# Altium project Project2.PrjPcb
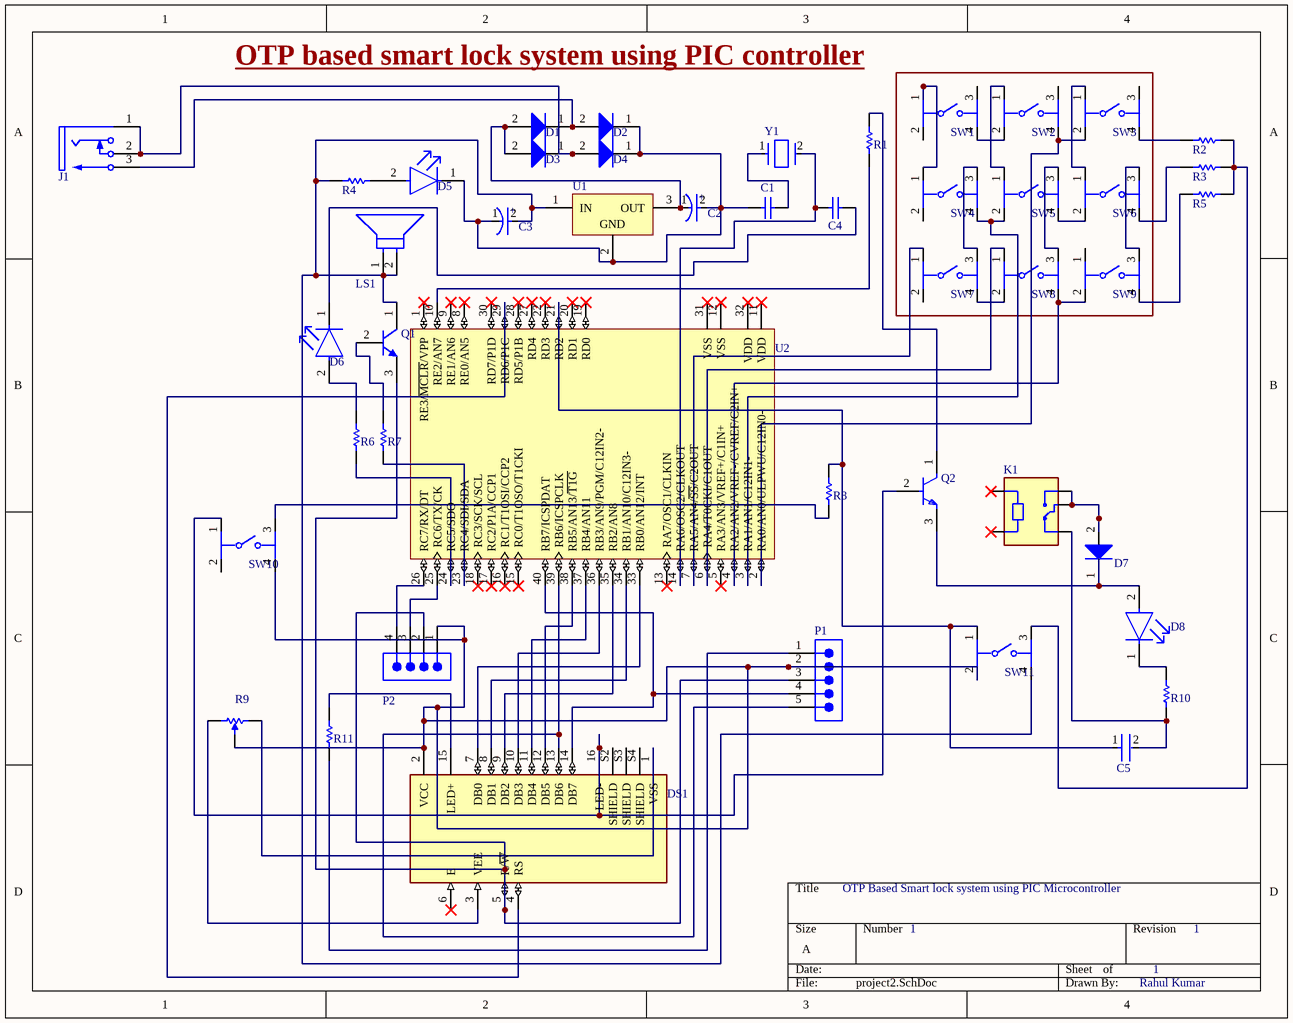
[diagram p0: project2.SchDoc]
1 sheet, 46 parts. Net scope: global (net labels, ports and power ports of the same name join across sheets).
Board files: project2.PcbDoc, PCB1.PcbDoc

## Sheet project2.SchDoc
size A; SheetNumber: 1; SheetTotal: 1

### Parts
C1  GRM188R71H102KA01D  [CAPC1608X90X35NL10T15]  (value not drawn)
C2  EEUFM1V221L  [FP-RAD-TH-D_8_0_5-L_15_1-MFG]  (value not drawn)
C3  EEUHD1E101  [FP-RAD-TH-D_6_3_0_5-L_11-MFG]  (value not drawn)
C4  GRM188R71H102KA01D  [CAPC1608X90X35NL10T15]  (value not drawn)
C5  06035A221JAT2A  [FP-0603-L_1_6_0_15-W_0_81-IPC_B]  (value not drawn)
D1  BAT54HT1G  [ONSC-SOD-323-2-477-02_V]  (value not drawn)
D2  BAT54HT1G  [ONSC-SOD-323-2-477-02_V]  (value not drawn)
D3  BAT54HT1G  [ONSC-SOD-323-2-477-02_V]  (value not drawn)
D4  BAT54HT1G  [ONSC-SOD-323-2-477-02_V]  (value not drawn)
D5  LTST-C190GKT  [FP-LTST-C190GKT-MFG]  (value not drawn)
D6  LTST-C190GKT  [FP-LTST-C190GKT-MFG]  (value not drawn)
D7  BAT54HT1G  [ONSC-SOD-323-2-477-02_V]  (value not drawn)
D8  LTST-C190GKT  [FP-LTST-C190GKT-MFG]  (value not drawn)
DS1  RC1602B-BIW-CSV  [LCD_RC1602B-BIW-CSV]  (value not drawn)
J1  RAPC712X  [SWITCH-RAPC712X-3_V]  (value not drawn)
K1  SRD-05VDC-SL-C  [RELAY_SRD-05VDC-SL-C]  (value not drawn)
LS1  PKM17EPPH4001-B0  [FP-PKM17EPPH4001-B0-MFG]  (value not drawn)
P1  653105124022  [653105124022]  (value not drawn)
P2  679304124022  [679304124022]  (value not drawn)
Q1  BC547B  [ONSC-TO-92-3-29-11]  (value not drawn)
Q2  BC548  [FP-135AN-MFG]  (value not drawn)
R1  ERJ-8GEY0R00V  [RESC3216X70X50NL05T20]  (value not drawn)
R2  ERJ-8GEY0R00V  [RESC3216X70X50NL05T20]  (value not drawn)
R3  ERJ-8GEY0R00V  [RESC3216X70X50NL05T20]  (value not drawn)
R4  ERJ-8GEY0R00V  [RESC3216X70X50NL05T20]  (value not drawn)
R5  ERJ-8GEY0R00V  [RESC3216X70X50NL05T20]  (value not drawn)
R6  ERJ-8GEY0R00V  [RESC3216X70X50NL05T20]  (value not drawn)
R7  ERJ-8GEY0R00V  [RESC3216X70X50NL05T20]  (value not drawn)
R8  ERJ-8GEY0R00V  [RESC3216X70X50NL05T20]  (value not drawn)
R9  3296W-1-102LF  [BOUR-3296W-1-3]  (value not drawn)
R10  ERJ-8GEY0R00V  [RESC3216X70X50NL05T20]  (value not drawn)
R11  ERJ-8GEY0R00V  [RESC3216X70X50NL05T20]  (value not drawn)
SW1  1-1825910-4  [FP-1-1825910-4-MFG]  (value not drawn)
SW2  1-1825910-4  [FP-1-1825910-4-MFG]  (value not drawn)
SW3  1-1825910-4  [FP-1-1825910-4-MFG]  (value not drawn)
SW4  1-1825910-4  [FP-1-1825910-4-MFG]  (value not drawn)
SW5  1-1825910-4  [FP-1-1825910-4-MFG]  (value not drawn)
SW6  1-1825910-4  [FP-1-1825910-4-MFG]  (value not drawn)
SW7  1-1825910-4  [FP-1-1825910-4-MFG]  (value not drawn)
SW8  1-1825910-4  [FP-1-1825910-4-MFG]  (value not drawn)
SW9  1-1825910-4  [FP-1-1825910-4-MFG]  (value not drawn)
SW10  1-1825910-4  [FP-1-1825910-4-MFG]  (value not drawn)
SW11  1-1825910-4  [FP-1-1825910-4-MFG]  (value not drawn)
U1  L7805CV  [TO220]  (value not drawn)
U2  PIC16F887-I/P  [PDIP600-P40]  (value not drawn)
Y1  ABLS-8.000MHZ-B2-T  [FP-ABLS-MFG]  (value not drawn)

### Nets
NetC1_1: C1.1 C2.2(A) C3.1(C) D2.1(K) D4.1(K) D5.1(C) U1.2(GND)
NetC1_2: C1.2 Y1.1
NetC2_1: C2.1(C) D1.2(A) D3.2(A) U1.3(OUT)
NetC3_2: C3.2(A) LS1.1 LS1.2 Q1.1(C) R4.2 SW11.4 U1.1(IN)
NetC4_1: C4.1 D6.1(C)
NetC4_2: C4.2 U2.14(RA6/OSC2/CLKOUT) Y1.2
NetC5_1: C5.1 R8.2 SW11.1 U2.21(RD2)
NetC5_2: C5.2 K1.NC R10.1
NetD1_1: D1.1(K) D2.2(A) J1.3
NetD3_1: D3.1(K) D4.2(A) J1.1 J1.2
NetD5_2: D5.2(A) R4.1
NetD6_2: D6.2(A) R6.2
NetD7_1: D7.1(K) D8.2(A) Q2.3(E)
NetD7_2: D7.2(A) K1.COM K1.NO
NetD8_1: D8.1(C) R10.2
NetDS1_1: DS1.1(VSS) R9.2(B)
NetDS1_2: DS1.2(VCC) P1.2 P2.1 R9.3(TAP) SW10.4 SW11.2
NetDS1_3: DS1.3(VEE) R9.1(A)
NetDS1_4: DS1.4(RS) U2.29(RD6/P1C)
NetDS1_5: DS1.5(R/~{W}) P1.3 P2.2 Q1.3(E)
NetDS1_7: DS1.7(DB0) U2.33(RB0/AN12/INT)
NetDS1_8: DS1.8(DB1) U2.34(RB1/AN10/C12IN3-)
NetDS1_9: DS1.9(DB2) U2.35(RB2/AN8)
NetDS1_10: DS1.10(DB3) U2.36(RB3/AN9/PGM/C12IN2-)
NetDS1_11: DS1.11(DB4) U2.37(RB4/AN11)
NetDS1_12: DS1.12(DB5) U2.38(RB5/AN13/~{T1G})
NetDS1_13: DS1.13(DB6) P1.5 U2.39(RB6/ICSPCLK)
NetDS1_14: DS1.14(DB7) P1.4 U2.40(RB7/ICSPDAT)
NetDS1_15: DS1.15(LED+) R11.2
NetDS1_16: DS1.16(LED-) Q2.2(B) SW10.1
NetP1_1: P1.1 R11.1
NetP2_3: P2.3 U2.25(RC6/TX/CK)
NetP2_4: P2.4 U2.26(RC7/RX/DT)
NetQ1_2: Q1.2(B) R7.2
NetQ2_1: Q2.1(C) R1.1
NetR1_2: R1.2 U2.10(RE2/AN7)
NetR2_1: R2.1 R3.1 R5.1 SW11.3
NetR2_2: R2.2 SW3.4
NetR3_2: R3.2 SW6.4
NetR5_2: R5.2 SW9.4
NetR6_1: R6.1 U2.24(RC5/SDO)
NetR7_1: R7.1 U2.23(RC4/SDI/SDA)
NetR8_1: R8.1 SW10.3
NetSW1_1: SW1.1 SW4.1
NetSW1_4: SW1.4 SW2.2
NetSW2_1: SW2.1 SW5.1
NetSW2_4: SW2.4 SW3.2 U2.2(RA0/AN0/ULPWU/C12IN0-)
NetSW3_1: SW3.1 SW6.1
NetSW4_3: SW4.3 SW7.3
NetSW4_4: SW4.4 SW5.2 U2.3(RA1/AN1/C12IN1-)
NetSW5_3: SW5.3 SW8.3
NetSW5_4: SW5.4 SW6.2
NetSW6_3: SW6.3 SW9.3
NetSW7_1: SW7.1 U2.7(RA5/AN4/~{SS}/C2OUT)
NetSW7_4: SW7.4 SW8.2
NetSW8_1: SW8.1 U2.6(RA4/T0CKI/C1OUT)
NetSW8_4: SW8.4 SW9.2 U2.4(RA2/AN2/VREF-/CVREF/C2IN+)

Not connected (* = marked no-connect by the designer): DS1 6(E)* S2(SHIELD) S3(SHIELD) S4(SHIELD); K1 A1* A2*; SW1 2 3; SW2 3; SW3 3; SW4 2; SW7 2; SW9 1; SW10 2; U2 1(RE3/~{MCLR}/VPP)* 5(RA3/AN3/VREF+/C1IN+)* 8(RE0/AN5)* 9(RE1/AN6)* 11(VDD)* 12(VSS)* 13(RA7/OSC1/CLKIN)* 15(RC0/T1OSO/T1CKI)* 16(RC1/T1OSI/CCP2)* 17(RC2/P1A/CCP1)* 18(RC3/SCK/SCL)* 19(RD0)* 20(RD1)* 22(RD3)* 27(RD4)* 28(RD5/P1B)* 30(RD7/P1D)* 31(VSS)* 32(VDD)*

### Notes on the sheet
- OTP based smart lock system using PIC controller
- OTP Based Smart lock system using PIC Microcontroller
- 1
- Rahul Kumar
- (in symbol CMP-05427-000678-1) +
- (in symbol CMP-05427-000916-1) +

### Library data of the parts
C1 C4 = CMP-2006-02891-1: Manufacturer: Murata; Part Number: GRM188R71H102KA01D
C2 = CMP-05427-000678-1: Aluminum Electrolytic Capacitors (Radial Lead Type) 220uF ±20% 35V; Ripple Current: 1.24A; Impedance: 41mR; Lead Length: 17mm; Life (Hours): 3000Hour; Lead Diameter: 0.6mm; Dielectric Material: Aluminium; Dissipation Factor: 0.12%; Package Quantity: 200; Tolerance: 20%; Series: FM; Voltage Rating: 35V; Lead Pitch: 3.5mm; Radiation Hardening: No; Construction: RADIAL; RoHS Compliant: Yes; REACH SVHC: Yes; Lead Free: Lead Free; Height - Seated (Max): 0.65inch; Length: 15mm; Diameter: 8mm; Mount: Through Hole; Number of Pins: 2; Height: 15mm; Voltage: 35V; Case/Package: Radial; Packaging: Bulk; Min Operating Temperature: -40°C; Voltage Rating (DC): 35V; ESR (Equivalent Series Resistance): 41mR; Capacitance: 220uF; Max Operating Temperature: 105°C; Termination: Radial
C3 = CMP-05427-000916-1: Aluminum Electrolytic Capacitors (Radial Lead Type) AEC-Q200 Qualified 100uF ±20% 25V; Ripple Current: 130mA; Lead/Base Style: Straight; Lead Diameter: 0.5mm; Life (Hours): 1000Hour; Polarity: Polar; Radiation Hardening: No; Voltage Rating: 25V; Tolerance: 20%; Series: Automotive, AEC-Q200, HD; Case/Package: Radial; REACH SVHC: No SVHC; Packaging: Bulk; Lead Pitch: 2.5mm; Mount: Through Hole; Min Operating Temperature: -55°C; Diameter: 6.3mm; Height - Seated (Max): 0.5inch; Capacitance: 100uF; Max Operating Temperature: 105°C; Construction: RADIAL; Package Quantity: 200; Termination: Radial; Height: 11.2mm; Ripple Current (AC): 130mA; RoHS Compliant: Yes; Voltage Rating (DC): 25V; Voltage: 25V; Number of Pins: 2; Length: 11.2mm
C5 = CMP-2006-04275-2: General Purpose Ceramic Capacitor, 0603, 220pF, 5%, NP0, 30ppm/°C, 50V; Insulation Resistance: 100GR; Dielectric: C0G; REACH SVHC: No SVHC; Height: 0.63mm; Lead Free: Lead Free; Case/Package: 0603; Package Quantity: 1; Length: 1.6mm; Min Operating Temperature: -55°C; Temperature Coefficient: 30ppm/°C; Width: 0.81mm; Voltage Rating: 50V; Capacitance: 220pF; Tolerance: 5%; Dielectric Material: Ceramic; Contact Plating: Tin; Thickness: 0.035inch; Mount: Surface Mount; Case Code (Imperial): 0603; Depth: 0.81mm; Voltage Rating (DC): 50V; Number of Pins: 2; RoHS Compliant: Yes; Packaging: Tape and Reel; Voltage: 50V; Case Code (Metric): 1608; Max Operating Temperature: 125°C; Termination: SMD/SMT; Radiation Hardening: No
D1-D4 D7 = CMP-1055-00462-1: Schottky Barrier Diode, 2-Pin SOD-323, Pb-Free, Tape and Reel; Manufacturer: On Semiconductor; Configuration: Single; trr Max (ns): 5; IFSM Max (A): 0.6; ComponentLink3URL: http://www.onsemi.com/pub_link/Collateral/477-02.PDF.1; PackageDescription: 2-Pin SOD, Body 1.7 x 1.25 mm; ComponentLink2URL: http://www.onsemi.cn/pub_link/Collateral/BAT54HT1-D.PDF; ComponentLink3Description: Package Specification; ComponentLink2Description: Datasheet; DatasheetVersion: Rev. 6; PackageReference: SOD-323-2-477-02; RoHS: TRUE; ComponentLink1URL: http://www.onsemi.com/; Packing: Tape and Reel; PartNumber: BAT54HT1G; Mounting Technology: Surface Mount; ComponentLink1Description: Manufacturer URL; PackageVersion: Rev. H, 03/2007
D5 D6 D8 = CMP-22017-000005-2: LED GREEN CLEAR CHIP SMD; Dominant Wavelength: 569nm; Reverse Voltage: 5V; Lens Color: Colorless; Viewing Angle: 130°; Voltage: 2V; Forward Current: 30mA; Power Dissipation: 100mW; Luminous Intensity: 6mcd; Number of LEDs: 1; Forward Voltage: 2.1V; Wavelength: 565nm; Test Current: 10mA; Min Operating Temperature: -55°C; Lens Style: Clear; Mount: Surface Mount; Width: 0.8mm; Packaging: Tape and Reel; Lens Transparency: Clear; Case Code (Metric): 1608; Depth: 0.8mm; Case Code (Imperial): 0603; Case/Package: 0603; Number of Pins: 2; Max Operating Temperature: 85°C; Lead Free: Lead Free; Number of Elements: 1; Length: 1.6mm; Height: 0.8mm; Package Quantity: 1; Power Rating: 100mW; Radiation Hardening: No; Illumination Color: Green; Color: Green
DS1 = RC1602B-BIW-CSV: Display: LCD; alphanumeric; STN Negative; 16x2; blue; LED; PIN: 16; MF: Raystar; Value: *; SnapEDA_Link: https://www.snapeda.com/parts/RC1602B-BIW-CSV/Raystar/view-part/?ref=snap; Availability: Not in stock; Price: None; Package: None; Check_prices: https://www.snapeda.com/parts/RC1602B-BIW-CSV/Raystar/view-part/?ref=eda; MP: RC1602B-BIW-CSV
J1 = CMP-2000-05383-1: Conn Powerjack Mini R/A PCMT, 5 A, 3-Pin THD, RoHS; Manufacturer: Switchcraft; Gender: Male; Current Rating: 5A; Connector Type: Jack; Dynamic Catalog: SwitchcraftInc; Other Names: Q2387461 / Q2526383 / RAPC712X-ND / SC237; Internal Switch(s): SingleSwitch,NormallyClosed; Catalog Drawings: RAPC7(1,2)2XSide / RAPC7(1,2)2XTop; Plug/Mating Plug Diameter: 2.5mmID,5.5mmOD; Number of Positions/Contacts: 2Conductors,2Contacts; Shielding: Unshielded; Mating Products: SC1539-ND / -CONNPLUGMINIPWR2CONDBLK/RED / SC1051-ND / -CONNPLUGMINIPOWER2CONDBLACK; Mounting Type: ThroughHole,RightAngle; Manufacturer URL: http://www.switchcraft.com/; Contact Material: Brass; Standard Package: 2,500; RoHS Information: SwitchcraftRoHSInfo; Termination: SolderEyelet(s); Housing Color: Black; Datasheet Version: Rev. A, 08/2005; Family: Barrel-PowerConnectors; Housing Material: Thermoplastic; Color: Black; Datasheet URL: https://datasheet.ciiva.com/391/rapc712x-cd-391666.pdf; Category: Connectors,Interconnects; Contact Material - Plating: Nickel
K1 = SRD-05VDC-SL-C: 5V Trigger Relay Module For Arduino And Raspberry Pi 5V Trigger Relay Module For Arduino And Raspberry Pi; MF: Songle Relay; Check_prices: https://www.snapeda.com/parts/SRD-05VDC-SL-C/Songle+Relay/view-part/?ref=eda; Value: *; Availability: Not in stock; Price: None; Package: NON STANDARD-5 Songle Relay; MP: SRD-05VDC-SL-C; SnapEDA_Link: https://www.snapeda.com/parts/SRD-05VDC-SL-C/Songle+Relay/view-part/?ref=snap
LS1 = CMP-06202-000027-1: AUDIO PIEZO TRANSDUCER 25V TH; Capacitance: 7nF; Self Resonant Frequency: 4kHz; Voltage Rating: 3V; Washable: No; Package Quantity: 600; Height: 7mm; Radiation Hardening: No; Lead Free: Lead Free; Max Operating Temperature: 70°C; REACH SVHC: No SVHC; Packaging: Bulk; Min Operating Temperature: -20°C; Diameter: 17mm; Voltage Rating (DC): 25V; Max Frequency: 4kHz; Nominal Input Voltage: 3V; Mount: Through Hole; Max Supply Voltage: 25V; Frequency: 4kHz; Termination: Solder
P1 = CMP-1502-00760-2: NexarPartId: 18818279; Contact Resistance: 20mΩ; Number of Contacts: 5; Pitch: 1.25mm; Gender: Male; Operating Supply Voltage: 125V; Insulation Resistance: 100MΩ; Insulation: Insulated; Current Rating: 1A; Connector Type: Male Pin; Orientation: Vertical; Contact Material: Copper; Contact Mating Length: 2.159mm; REACH SVHC: Unknown; Contact Gender: Male; Length: 11mm; Min Operating Temperature: -40°C; Width: 11mm; Lead Pitch: 1.25mm; RoHS: Compliant; Height: 4.75mm; Number of Pins: 5; Color: Beige, White; Flammability Rating: UL94 V-0; Mount: Surface Mount; Packaging: Tape and Reel; Number of Rows: 1; Termination: SMD/SMT; Max Operating Temperature: 85°C; Contact Plating: Tin; Housing Material: Nylon; Number of Positions: 5; Voltage Rating: 125V
P2 = CMP-1502-00723-2: NexarPartId: 18818283; Voltage Rating: 50V; Contact Resistance: 20mΩ; Number of Positions: 4; Current Rating: 1A; Pitch: 1.5mm; Gender: Male; Connector Type: Male Pin; Insulation Resistance: 100MΩ; Insulation: Insulated; Number of Pins: 4; Max Operating Temperature: 85°C; Contact Plating: Tin; Contact Gender: Male; Min Operating Temperature: -25°C; Termination: SMD/SMT; Orientation: Vertical; Color: Beige, White; Operating Supply Voltage: 50V; Contact Material: Copper; Housing Material: Nylon; Width: 9mm; Lead Pitch: 1.5mm; Packaging: Tape and Reel; Height: 5mm; Flammability Rating: UL94 V-0; REACH SVHC: No SVHC; Length: 9mm; Number of Rows: 1; RoHS: Compliant; Mount: Surface Mount; Number of Contacts: 4
Q1 = CMP-1048-01467-1: Amplifier Transistor, NPN Silicon, 3-Pin TO-92, Bulk Box; Manufacturer: On Semiconductor; IC Continuous (A): 0.1; fT Min (MHz): 150; DatasheetVersion: Rev. 7; ComponentLink1URL: http://www.onsemi.com/; Polarity: NPN; RoHS: FALSE; ComponentLink1Description: Manufacturer URL; Packing: Bulk Box; PackageDescription: 3-Pin Transistor Outline, Body 4.825 x 3.685 mm, Pitch 1.27 mm; ComponentLink3URL: http://www.onsemi.cn/pub_link/Collateral/2N6426-D.PDF; ComponentLink2Description: Datasheet; PackageVersion: Rev. AM; PackageReference: TO-92-3-29-11_AM_SL; ComponentLink3Description: Package Specification; Mounting Technology: Through Hole; PartNumber: BC547B; ComponentLink2URL: http://www.onsemi.com/pub_link/Collateral/BC546-D.PDF
Q2 = CMP-00278-84324557-1: BC548 Bulk Through Hole NPN Single Bipolar (BJT) Transistor 110 @ 2mA 5V 100mA 500mW 300MHz; Collector Emitter Breakdown Voltage: 30V; Collector Emitter Saturation Voltage: 250mV; hFE Min: 110; Number of Elements: 1; Gain Bandwidth Product: 300MHz; RoHS: Compliant; NexarPartId: 84324557; Polarity: NPN; Min Operating Temperature: -65°C; Number of Pins: 3; Termination: Through Hole; Mount: Through Hole; Voltage Rating (DC): 30V; Radiation Hardening: No; Frequency: 300MHz; Weight: 200mg; Max Frequency: 300MHz; Max Collector Current: 100mA; Transition Frequency: 300MHz; Max Power Dissipation: 500mW; Power Dissipation: 500mW; REACH SVHC: No SVHC; Collector Emitter Voltage (VCEO): 30V; Case/Package: TO-92; Max Operating Temperature: 150°C; Element Configuration: Single; Current Rating: 100mA; Lead Free: Lead Free; Collector Base Voltage (VCBO): 30V; Emitter Base Voltage (VEBO): 5V; Packaging: Bulk
R1-R8 R10 R11 = CMP-2003-00541-1: Manufacturer: Panasonic; Part Number: ERJ-8GEY0R00V
R9 = CMP-1747-00002-1: Square Trimpot(R) Trimming Potentiometer, 1000 Ohm, -55 to 125 degC, 3-Pin THD, RoHS, Tube; Case\Package: 0603; Tolerance: 1%; Power Rating: 100 mW; Voltage Rating: 75 V; Resistance: 4.7 kohm; ComponentLink2URL: http://www.bourns.com/docs/Product-Datasheets/3296.pdf; Packaging: Tape and Reel; REACH SVHC: Yes; ComponentLink1URL: http://www.bourns.com/; Case Code (Metric): 1608; Width: 0.8 mm; ComponentLink1Description: Manufacturer URL; DatasheetVersion: May-16; Max Operating Temperature: 155 degC; PackageReference: 3296W-1-3; PackageDescription: 3-Pin Through Hole Device, Body 9.53 x 4.83 mm, Pitch 2.54 mm; Weight: 7.1E-05 oz; ComponentLink2Description: Datasheet; RoHSCompliant: true; Min Operating Temperature: -55 degC; Radiation Hardening: No; Case Code (Imperial): 0603; Length: 1.6 mm; Package Quantity: 5000; Pins: 2; Mount: Surface Mount; Height: 0.45 mm
SW1-SW11 = CMP-03407-000002-1: SWITCH TACTILE SPST-NO 0.05A 24V; Manufacturer: TE Connectivity; Operating Force: 160gf; Contact Current Rating: 50mA; Electromechanical Life: 100000Cycles; Contact Resistance: 100mΩ; Octopart: https://octopart.com/1-1825910-4-te+connectivity-42270468; ComponentLink2URL: https://www.te.com/commerce/DocumentDelivery/DDEController?Action=showdoc&DocId=Customer+Drawing%7F1825910%7FC10%7Fpdf%7FEnglish%7FENG_CD_1825910_C10.pdf%7F1-1825910-4; Throw Configuration: SPST-NO; Height: 9.8mm; Package: 1-1825910-4; Automotive: No; Device Class L2: Switches; Voltage Rating Dc: 24V; Temperature Range High: +85°C; Device Class L3: Tactile Switches; Mouser Description: Tactile Switches 6MM ACTHIGH TEMP TACT SWITCH; Manufacturer Part Number: 1-1825910-4; Lead Free: Yes; Temperature Range Low: -35°C; Digikey Description: SWITCH TACTILE SPST-NO 0.05A 24V; Device Class L1: Electromechanical; Mount: Through Hole; RoHS: TRUE; ComponentLink2Description: Datasheet; Temperature: -35°C to +85°C; Category: Switch
U1 = CMP-0244-00483-1: Positive Voltage Regulator, 5V, 3-Pin TO-220; PackageDescription: TO, Thru-Hole, Vertical, Heatsink Mounted; 3 In-Line Leads; Pitch 2.54 mm; ComponentLink2Description: Datasheet; PackageReference: TO220; ComponentLink3URL: http://www.st.com/internet/com/TECHNICAL_RESOURCES/TECHNICAL_LITERATURE/PACKAGE_INFORMATION/CD00004649.pdf; DatasheetVersion: 16/11/2011; ComponentLink1Description: Manufacturer URL; ComponentLink1URL: http://www.st.com; PackageVersion: ver3.0; ComponentLink3Description: Package Specification; ComponentLink2URL: http://www.st.com/internet/com/TECHNICAL_RESOURCES/TECHNICAL_LITERATURE/DATASHEET/CD00000444.pdf
U2 = CMP-0115-00049-1: Flash-Based, 8-Bit CMOS Microcontroller with nanoWatt Technology, 8K (x14-Bit words) Program Memory, 624 Bytes Data Memory, 35 I/O pins, 40-Pin PDIP, Standard VDD Range, Industrial Temperature; PackageVersion: revBB, Aug-2009; DatasheetVersion: revF, Apr-2009; PackageDescription: 40-Lead Plastic Dual In-Line (P) - 600 mil Body [PDIP]; PackageReference: PDIP600-P40
Y1 = CMP-27762-009874-1: CRYSTAL 8.0000MHZ 18PF SMD; ESR (Equivalent Series Resistance): 80R; Operating Frequency: 8 MHz; Frequency Stability: 50ppm; Tolerance: 20ppm; Frequency: 8MHz; Min Operating Temperature: -20°C; Lead Free: Lead Free; Width: 4.7mm; Packaging: Tape and Reel; Series: ABLS; Accuracy: 20ppm; Length: 11.4mm; Frequency Tolerance: 20ppm; Termination: SMD/SMT; Number of Pins: 2; Radiation Hardening: No; Depth: 4.7mm; REACH SVHC: No SVHC; Contact Plating: Tin; Load Capacitance: 18pF; Case/Package: SMD/SMT; Mount: Surface Mount; Package Quantity: 1000; Max Operating Temperature: 70°C; Height: 0.165inch; Series Resistance: 80R